# EAGLE schematic MJ808 clone - all driver (EAGLE 9.0.0)
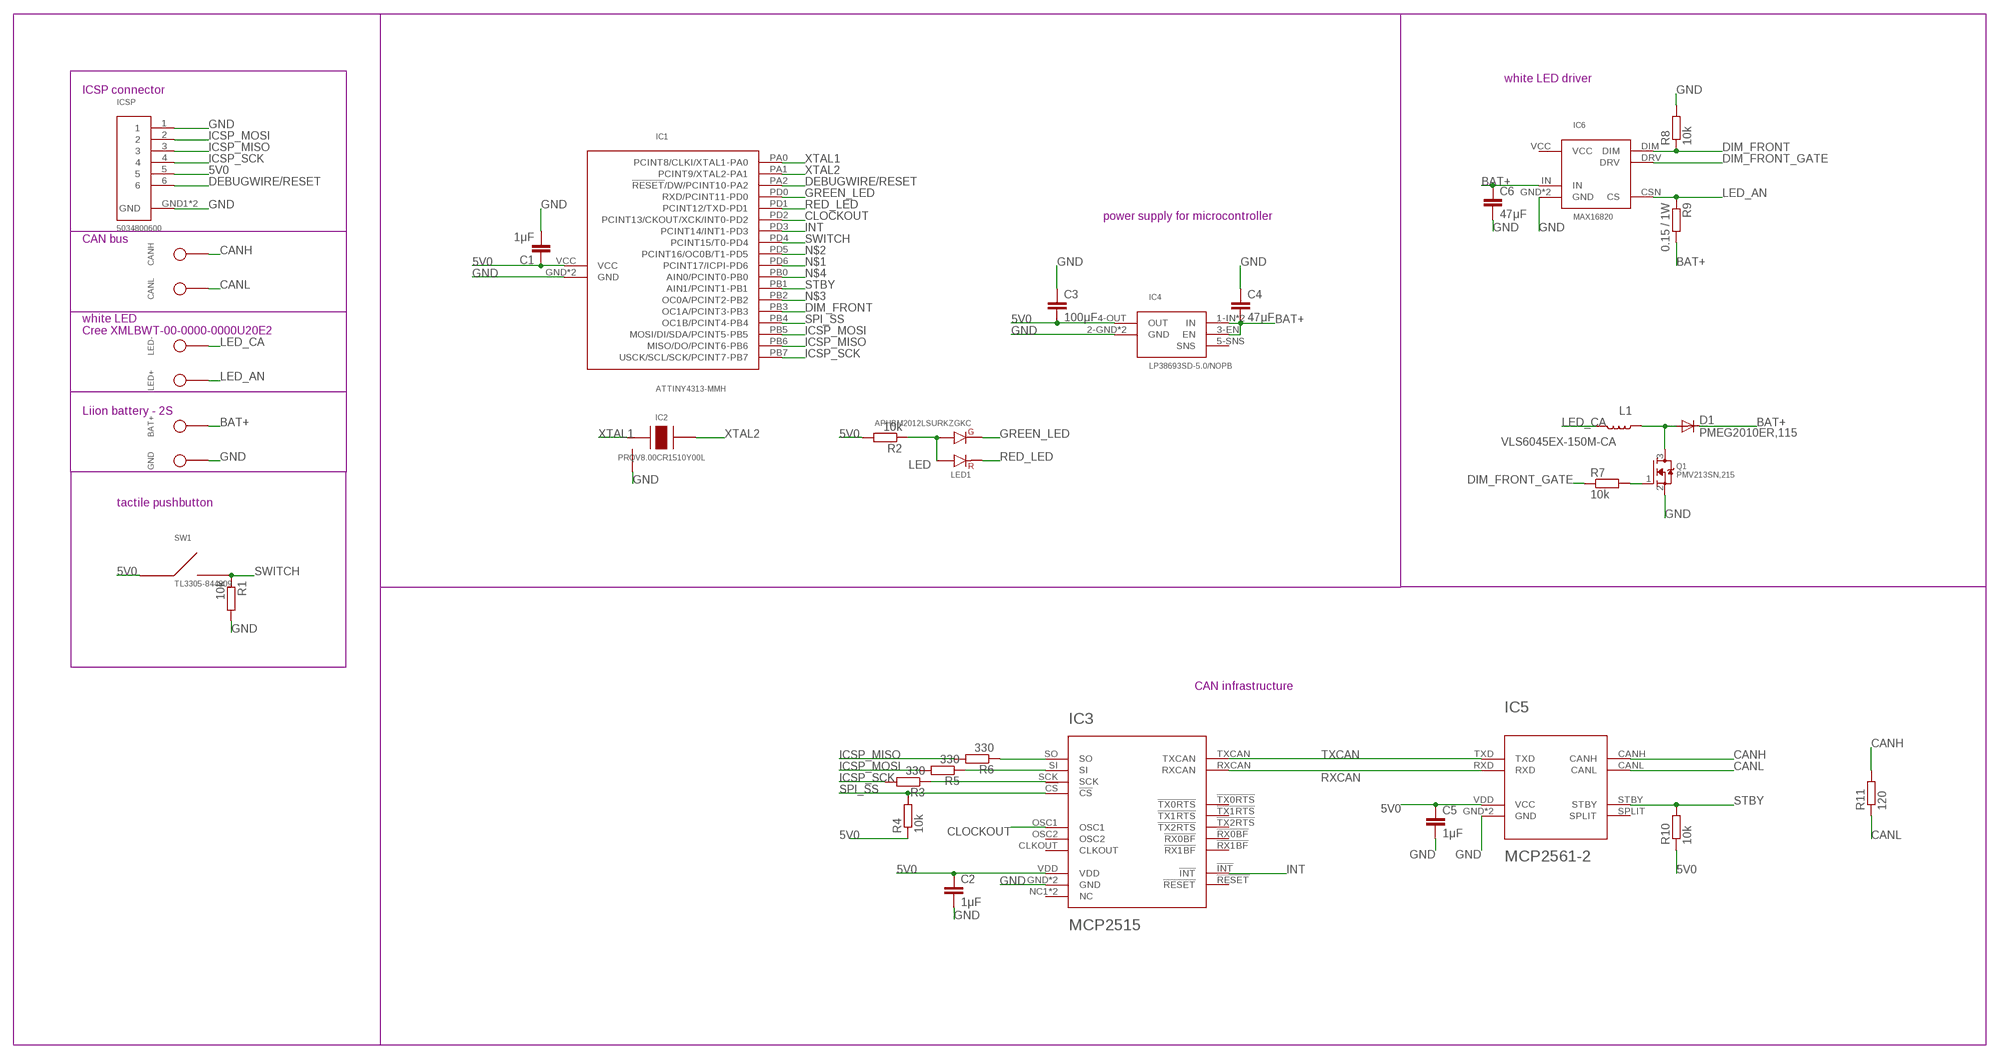
[diagram p0: schematic, sheet 1]

## Parts
BAT+  LiIon + Terminal  TP  [TH]
C1  1μF  C-EUC0402  [C0402]
C2  1μF  C-EUC0402  [C0402]
C3  100μF  C-EUC1206  [C1206]
C4  47μF  C-EUC0805  [C0805]
C5  1μF  C-EUC0402  [C0402]
C6  47μF  C-EUC0805  [C0805]
CANH  CAN high  TP  [TH]
CANL  CAN low  TP  [TH]
D1  PMEG2010ER,115  DIODE-SOD123  [SOD123]
GND  LiIon - Terminal  TP  [TH]
IC1  ATTINY4313-MMH  ATTINY4313VQFN-20  [VQFN-20]
IC2  PRQV8.00CR1510Y00L  PRQV  [SMT]
IC3  MCP2515  MCP2515-I-ML  [QFN20]
IC4  LP38693SD-5.0/NOPB  LP38693  [WSON6]
IC5  MCP2561-2  [DFN10]
IC6  MAX16820  [TDFN-6-EP]
ICSP  5034800600  5034800600  [SMT]
L1  VLS6045EX-150M-CA  INDUCTOR-SRN6045-33UH  [SRN6045]
LED1  APHBM2012LSURKZGKC  [SMD]
LED+  LED anode  TP  [TH]
LED-  LED cathode  TP  [TH]
Q1  PMV213SN,215  MOSFET-NREFLOW  [SOT23]
R1  10k  R-EU_R0402  [R0402]
R2  10k  R-EU_R0402  [R0402]
R3  330  R-EU_R0402  [R0402]
R4  10k  R-EU_R0402  [R0402]
R5  330  R-EU_R0402  [R0402]
R6  330  R-EU_R0402  [R0402]
R7  10k  R-EU_R0402  [R0402]
R8  10k  R-EU_R0402  [R0402]
R9  0.15 / 1W  R-EU_R1210  [R1210]
R10  10k  R-EU_R0402  [R0402]
R11  120  R-EU_R0805  [R0805]
SW1  TL3305-844809  [SMD]

## Nets
5V0 [VCC]: C1.1 C2.1 C3.2 C5.1 IC1.VCC IC3.VDD IC4.4-OUT(OUT) IC5.VDD(VCC) ICSP.5 R2.2 R4.1 R10.1 SW1.1 SW1.2
BAT+: BAT+.TP$1 C4.2 C6.1 D1.C IC4.1-IN(IN) IC4.3-EN(EN) IC4.6-IN(IN) IC6.IN R9.2
CANH [signal]: CANH.TP$1 IC5.CANH R11.2
CANL [signal]: CANL.TP$1 IC5.CANL R11.1
CLOCKOUT [signal]: IC1.PD2(PCINT13/CKOUT/XCK/INT0-PD2) IC3.OSC1
DEBUGWIRE/RESET [signal]: IC1.PA2(!RESET!/DW/PCINT10-PA2) ICSP.6
DIM_BRAKE_DRAIN: D1.A L1.1 Q1.3(D)
DIM_FRONT [signal]: IC1.PB3(OC1A/PCINT3-PB3) IC6.DIM R8.1
DIM_FRONT_GATE [signal]: IC6.DRV R7.1
GATE [signal]: Q1.1(G) R7.2
GND: C1.2 C2.2 C3.1 C4.1 C5.2 C6.2 GND.TP$1 IC1.GND IC1.GND1(GND) IC2.GND IC3.GND IC3.GND6(GND) IC4.2-GND(GND) IC4.GND1(GND) IC5.GND IC5.VSS(GND) IC6.GND IC6.GND1(GND) ICSP.1 ICSP.GND1(GND) ICSP.GND2(GND) Q1.2(S) R1.2 R8.2
GREEN_LED [signal]: IC1.PD0(RXD/PCINT11-PD0) LED1.3
ICSP_MISO [signal]: IC1.PB6(MISO/DO/PCINT6-PB6) ICSP.3 R6.2
ICSP_MOSI [signal]: IC1.PB5(MOSI/DI/SDA/PCINT5-PB5) ICSP.2 R5.2
ICSP_SCK [signal]: IC1.PB7(USCK/SCL/SCK/PCINT7-PB7) ICSP.4 R3.2
INT [signal]: IC1.PD3(PCINT14/INT1-PD3) IC3.!INT!
LED [signal]: LED1.1 LED1.4 R2.1
LED_AN: IC6.CSN(CS) LED+.TP$1 R9.1
LED_CA: L1.2 LED-.TP$1
N$1: IC1.PD6(PCINT17/ICPI-PD6)
N$2: IC1.PD5(PCINT16/OC0B/T1-PD5)
N$3: IC1.PB2(OC0A/PCINT2-PB2)
N$4: IC1.PB0(AIN0/PCINT0-PB0)
RED_LED [signal]: IC1.PD1(PCINT12/TXD-PD1) LED1.2
RXCAN: IC3.RXCAN IC5.RXD
SPI_MISO [signal]: IC3.SO R6.1
SPI_MOSI [signal]: IC3.SI R5.1
SPI_SCK [signal]: IC3.SCK R3.1
SPI_SS [signal]: IC1.PB4(OC1B/PCINT4-PB4) IC3.!CS! R4.2
STBY [signal]: IC1.PB1(AIN1/PCINT1-PB1) IC5.STBY R10.2
SWITCH [signal]: IC1.PD4(PCINT15/T0-PD4) R1.1 SW1.3 SW1.4
TXCAN: IC3.TXCAN IC5.TXD
XTAL1 [signal]: IC1.PA0(PCINT8/CLKI/XTAL1-PA0) IC2.XTAL1
XTAL2 [signal]: IC1.PA1(PCINT9/XTAL2-PA1) IC2.XTAL2
Unconnected: IC3.!RESET! IC3.!RX0BF! IC3.!RX1BF! IC3.!TX0RTS! IC3.!TX1RTS! IC3.!TX2RTS! IC3.CLKOUT IC3.NC1(NC) IC3.NC2(NC) IC3.OSC2 IC4.5-SNS(SNS) IC5.SPLIT

## Notes on the sheet
- white LED driver
- ICSP connector
- power supply for microcontroller
- CAN bus
- white LED
  Cree XMLBWT-00-0000-0000U20E2
- Liion battery - 2S
- tactile pushbutton
- CAN infrastructure

## Power pins joined to a net without a drawn wire
VCC: IC6.VCC

## Library data of the parts
BAT+ CANH CANL GND LED+ LED- = signal testpoint:TP
C1-C6 = rcl:C-EU: CAPACITOR, European symbol; SPICEPREFIX: C
D1 = diode:DIODE-: DIODE
IC1 = ATtiny4313 microcontroller:ATTINY4313; SPICEPREFIX: X
IC2 = PRQV8.00CR1510Y00L - 8MHz resonator:PRQV
IC3 = MCP2515-I-ML - Standalonce CAN Controller with SPI Interface:MCP2515-I-ML
IC4 = LP38693 5V LDO:LP38693
IC5 = MCP2561-2 - High-Speed CAN Transceiver:MCP2561-2
IC6 = MAX16820 LED Driver, constant current:MAX16820
ICSP = 5034800600 FPC Connector:5034800600
L1 = SparkFun-Coils:INDUCTOR: Inductors Resist changes in electrical current. Basically a coil of wire. SparkFun Products: SparkFun Load Cell Amplifier - HX711 <https://www.sparkfun.com/products/13879> IOIO-OTG - V2.2 <https://www.sparkfun.com/products/13613>; PROD_ID: NDUC-11627; VALUE: 33µH/±20%/1.4A
LED1 = APHBM2012LSURKZGKC:APHBM2012LSURKZGKC
Q1 = adafruit:MOSFET-N: N-Channel Mosfet 2N7002E - 60V 260mA SOT23 [Digikey: 2N7002ET1GOSTR-ND] - REEL BSH103 - 30V 850mA SOT23 [Digikey: 568-5013-1-ND]
R1-R11 = rcl:R-EU_: RESISTOR, European symbol; SPICEPREFIX: R
SW1 = TL3305-844809 SPST-NO Tact Switch:TL3305-844809

## Net classes
0 GND: width 0.254 mm, drill 0.254 mm, clearance 0.127 mm
1 VCC: width 0.254 mm, drill 0.254 mm, clearance 0.127 mm
2 signal: width 0.127 mm, drill 0.254 mm, clearance 0.127 mm